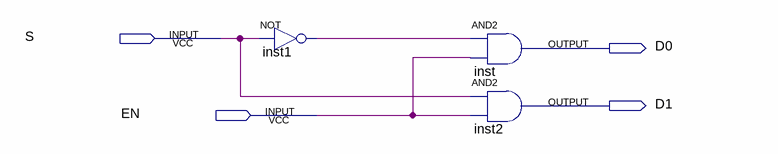
[diagram p0: schematic sheet]
// Quartus schematic DC2.bdf as structural Verilog: 3 symbols, 4 pins
module DC2 (
  input  S,
  input  EN,
  output D0,
  output D1
);

  wire inst1_out;

  not inst1 (inst1_out, S);
  and inst (D0, inst1_out, EN);
  and inst2 (D1, S, EN);
endmodule
